# Altium schematic sheet 1.47.schdoc
size 431 x 309 mm; Symbol: Sheet-Symbol_A3; Device: Sheet-Symbol_A3; Company: 嘉立创EDA; Version: V1.0; Page Size: A3; @Project Name: AVPE 1.47寸全面屏 C2C 伏安表; @Page Count: 1; @Update Date: 2024-05-06; @Create Date: 2024-05-02; @Schematic Name: Schematic1; @Page No: 1; @Page Name: P1
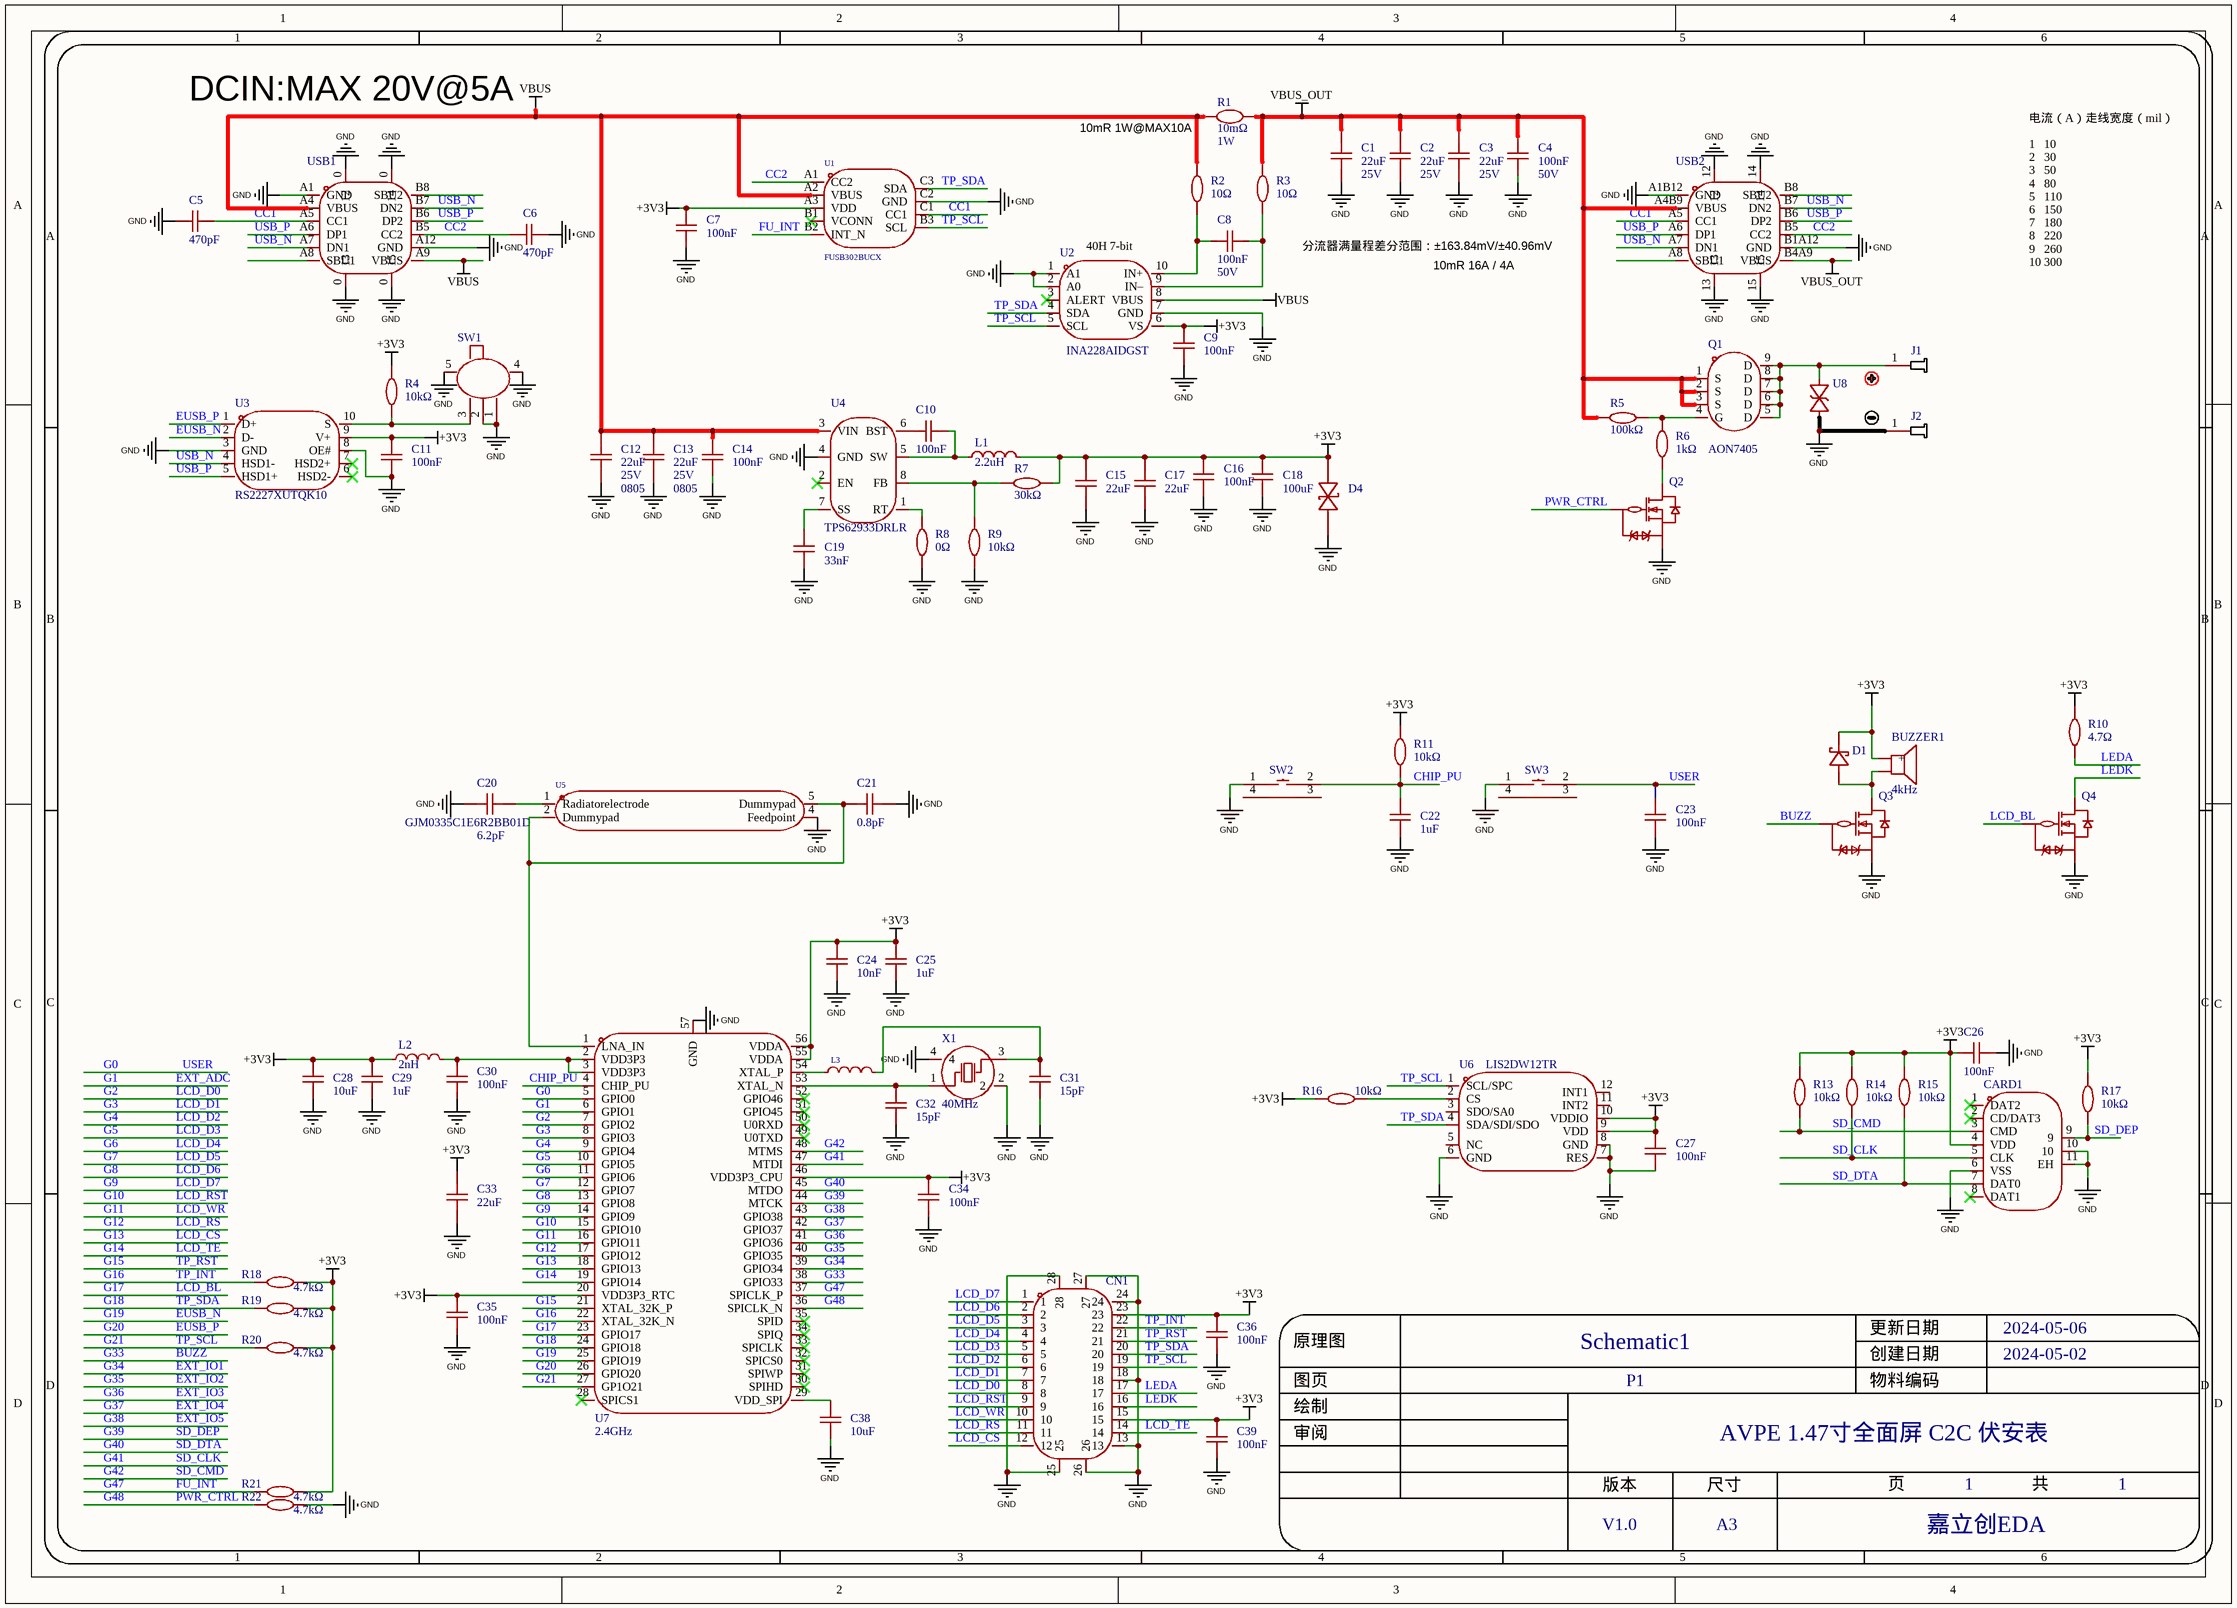
[diagram p0: 1.47.schdoc]

## Parts
BUZZER1  4kHz  [BUZ-SMD_L4.0-W4.0-P3.50-L]
C1  Voltage Rated: 25V  [C1206]  (hidden comment: 22uF)
C2  Voltage Rated: 25V  [C1206]  (hidden comment: 22uF)
C3  Voltage Rated: 25V  [C1206]  (hidden comment: 22uF)
C4  Voltage Rated: 50V  [C0402]  (hidden comment: 100nF)
C5  470pF  [C0402]
C6  470pF  [C0402]
C7  100nF  [C0402]
C8  Voltage Rated: 50V  [C0402]  (hidden comment: 100nF)
C9  100nF  [C0402]
C10  100nF  [C0402]
C11  100nF  [C0402]
C12  Supplier Footprint: 0805  Voltage Rated: 25V  [C0805]  (hidden comment: 22uF)
C13  Supplier Footprint: 0805  Voltage Rated: 25V  [C0805]  (hidden comment: 22uF)
C14  100nF  [C0402]
C15  22uF  [C0603]
C16  100nF  [C0402]
C17  22uF  [C0603]
C18  100uF  [C1206]
C19  33nF  [C0402]
C20  Manufacturer Part: GJM0335C1E6R2BB01D  [C0201]  (hidden comment: 6.2pF)
C21  0.8pF  [C0402]
C22  1uF  [C0402]
C23  100nF  [C0402]
C24  10nF  [C0402]
C25  1uF  [C0402]
C26  100nF  [C0402]
C27  100nF  [C0402]
C28  10uF  [C0402]
C29  1uF  [C0402]
C30  100nF  [C0402]
C31  15pF  [C0402]
C32  15pF  [C0402]
C33  22uF  [C0603]
C34  100nF  [C0402]
C35  100nF  [C0402]
C36  100nF  [C0402]
C38  10uF  [C0402]
C39  100nF  [C0402]
CARD1  5033981892  [TF-SMD_TF-110]  (value not drawn)
CN1  BM20B(0.8)-24DS-0.4V(51)  [CONN-SMD_BM20B-0.8-24DS-0.4V-51]  (value not drawn)
D1  1N4148WT  [SOD-523_L1.2-W0.8-LS1.6-RD]  (value not drawn)
D4  BDFN2C031V  [TSSLP-2-4_L1.0-W0.6-P0.65-BI]  (value not drawn)
J1  (no value)  [Banana_M2xφ4.4x7_2]
J2  (no value)  [Banana_M2xφ4.4x7_2]
L1  2.2uH  [L0805]
L2  2nH  [L0402]
L3  27nH  [IND-SMD_L1.0-W0.5-2]  (value not drawn)
Q1  AON7405  [DFN-8_L3.3-W3.3-P0.65-BL-3]
Q2  WNM6002-3/TR  [SOT-323-3_L2.0-W1.3-P1.30-LS2.1-BR]  (value not drawn)
Q3  WNM6002-3/TR  [SOT-323-3_L2.0-W1.3-P1.30-LS2.1-BR]  (value not drawn)
Q4  WNM6002-3/TR  [SOT-323-3_L2.0-W1.3-P1.30-LS2.1-BR]  (value not drawn)
R1  Power(Watts): 1W  [RES-SMD_L6.3-W3.3_HOLR2512]  (hidden comment: 10mΩ)
R2  10Ω  [R0402]
R3  10Ω  [R0402]
R4  10kΩ  [R0402]
R5  100kΩ  [R0402]
R6  1kΩ  [R0402]
R7  30kΩ  [R0402]
R8  0Ω  [R0402]
R9  10kΩ  [R0402]
R10  4.7Ω  [R0603]
R11  10kΩ  [R0402]
R13  10kΩ  [R0402]
R14  10kΩ  [R0402]
R15  10kΩ  [R0402]
R16  10kΩ  [R0402]
R17  10kΩ  [R0402]
R18  4.7kΩ  [R0402]
R19  4.7kΩ  [R0402]
R20  4.7kΩ  [R0402]
R21  4.7kΩ  [R0402]
R22  4.7kΩ  [R0402]
SW1  MINI MSK12CO2  [SW-SMD_MSK12CO2]  (value not drawn)
SW2  GT-TC021B-H018-L1  [SW-SMD_GT-TC021B-H018-L1]  (value not drawn)
SW3  GT-TC021B-H018-L1  [SW-SMD_GT-TC021B-H018-L1]  (value not drawn)
U1  FUSB302BUCX  [WLCSP-9_L1.3-W1.2-R3-C3-P0.40-TL]
U2  INA228AIDGST  [VSSOP-10_L3.0-W3.0-P0.50-LS4.9-BL]
U3  RS2227XUTQK10  [WQFN-10_L1.8-W1.4-P0.40-BL]
U4  TPS62933DRLR  [SOT-583-8_L2.1-W1.2-P0.50-LS1.6-BR]
U5  ANT162442ST-1000AM1  [ANT-SMD_6P-L1.6-W0.8-L]  (value not drawn)
U6  LIS2DW12TR  [LGA-12_L2.0-W2.0-P0.50-BL]
U7  2.4GHz  [QFN-56_L7.0-W7.0-P0.40-TL-EP4.0]
U8  BDFN2C241R  [DFN1006-2L-BI]  (value not drawn)
USB1  TYPEC-304A-ACP16O  [USB-TYPE-C-SMD_TYPE-C-16P-QTWT]  (value not drawn)
USB2  TYPEC-304A-ACP16O  [USB-SMD_TYPEC-304A-ACP16O]  (value not drawn)
X1  40MHz  [CRYSTAL-SMD_4P-L2.5-W2.0-BL]

## Nets
+3V3: BUZZER1.1(+) C7.1 C9.1 C11.1 C15.2 C16.1 C17.2 C18.2 C24.2 C25.2 C26.1 C27.2 C28.2 C29.2 C33.2 C34.1 C35.1 C36.1 C39.1 CARD1.4(VDD) CN1.15 CN1.23 D1.1(C) D4.2 L1.2 L2.1 R4.2 R7.2 R10.2 R11.2 R13.1 R14.1 R15.1 R16.2 R17.2 R18.1 R19.1 R20.1 R21.1 U1.A3(VDD) U2.6(VS) U3.9(V+) U6.9(VDD) U6.10(VDDIO) U7.20(VDD3P3_RTC) U7.46(VDD3P3_CPU) U7.55(VDDA) U7.56(VDDA)
GND: C1.1 C2.1 C3.1 C4.1 C5.2 C6.1 C7.2 C9.2 C11.2 C12.1 C13.1 C14.2 C15.1 C16.2 C17.1 C18.1 C19.1 C20.1 C21.2 C22.1 C23.2 C24.1 C25.1 C26.2 C27.1 C28.1 C29.1 C30.2 C31.1 C32.1 C33.1 C34.2 C35.2 C36.2 C38.1 C39.2 CARD1.6(VSS) CARD1.10 CARD1.11(EH) CN1.13 CN1.18 CN1.24 CN1.25 CN1.26 CN1.27 CN1.28 D4.1 J2.1 Q2.2(S) Q3.2(S) Q4.2(S) R8.1 R9.1 R22.1 SW1.1 SW1.2 SW1.4 SW1.5 SW2.1 SW3.1 U1.C2(GND) U2.1(A1) U2.2(A0) U2.7(GND) U3.3(GND) U3.8(OE#) U4.4(GND) U5.4(Feedpoint) U6.6(GND) U6.7(RES) U6.8(GND) U7.57(GND) U8.1(K) USB1.0(12) USB1.A1(GND) USB1.A12(GND) USB2.12 USB2.13 USB2.14 USB2.15 USB2.A1B12(GND) USB2.B1A12(GND) X1.2 X1.4
VBUS: C12.2 C13.2 C14.1 R1.1 R2.2 U1.A2(VBUS) U2.8(VBUS) U4.3(VIN) USB1.A4(VBUS) USB1.A9(VBUS)
VBUS_OUT: C1.2 C2.2 C3.2 C4.2 Q1.1(S) Q1.2(S) Q1.3(S) R1.2 R3.2 R5.2 USB2.A4B9(VBUS) USB2.B4A9(VBUS)
BUZZ: Q3.1(G) U7.38(GPIO33)  [also labelled G33]
CC1: C5.1 U1.C1(CC1) USB1.A5(CC1) USB2.A5(CC1)
CC2: C6.2 U1.A1(CC2) USB1.B5(CC2) USB2.B5(CC2)
CHIP_PU: C22.2 R11.1 SW2.2 U7.4(CHIP_PU)
EUSB_N: U3.2(D-) U7.25(GPIO19)  [also labelled G19]
EUSB_P: U3.1(D+) U7.26(GPIO20)  [also labelled G20]
EXT_ADC: U7.6(GPIO1)  [also labelled G1]
EXT_IO1: U7.39(GPIO34)  [also labelled G34]
EXT_IO2: U7.40(GPIO35)  [also labelled G35]
EXT_IO3: U7.41(GPIO36)  [also labelled G36]
EXT_IO4: U7.42(GPIO37)  [also labelled G37]
EXT_IO5: U7.43(GPIO38)  [also labelled G38]
FU_INT: R21.2 U1.B2(INT_N) U7.37(SPICLK_P)  [also labelled G47]
G0: C23.1 SW3.2 U7.5(GPIO0)  [also labelled USER]
G2: CN1.8 U7.7(GPIO2)  [also labelled LCD_D0]
G3: CN1.7 U7.8(GPIO3)  [also labelled LCD_D1]
G4: CN1.6 U7.9(GPIO4)  [also labelled LCD_D2]
G5: CN1.5 U7.10(GPIO5)  [also labelled LCD_D3]
G6: CN1.4 U7.11(GPIO6)  [also labelled LCD_D4]
G7: CN1.3 U7.12(GPIO7)  [also labelled LCD_D5]
G8: CN1.2 U7.13(GPIO8)  [also labelled LCD_D6]
G9: CN1.1 U7.14(GPIO9)  [also labelled LCD_D7]
G10: CN1.9 U7.15(GPIO10)  [also labelled LCD_RST]
G11: CN1.10 U7.16(GPIO11)  [also labelled LCD_WR]
G12: CN1.11 U7.17(GPIO12)  [also labelled LCD_RS]
G13: CN1.12 U7.18(GPIO13)  [also labelled LCD_CS]
G14: CN1.14 U7.19(GPIO14)  [also labelled LCD_TE]
G15: CN1.21 U7.21(XTAL_32K_P)  [also labelled TP_RST]
G16: CN1.22 R18.2 U7.22(XTAL_32K_N)  [also labelled TP_INT]
G17: Q4.1(G) U7.23(GPIO17)  [also labelled LCD_BL]
G18: CN1.20 R19.2 U1.C3(SDA) U2.4(SDA) U6.4(SDA/SDI/SDO) U7.24(GPIO18)  [also labelled TP_SDA]
G21: CN1.19 R20.2 U1.B3(SCL) U2.5(SCL) U6.1(SCL/SPC) U7.27(GP1O21)  [also labelled TP_SCL]
G39: CARD1.9 R17.1 U7.44(MTCK)  [also labelled SD_DEP]
G40: CARD1.7(DAT0) R15.2 U7.45(MTDO)  [also labelled SD_DTA]
G41: CARD1.5(CLK) R14.2 U7.47(MTDI)  [also labelled SD_CLK]
G42: CARD1.3(CMD) R13.2 U7.48(MTMS)  [also labelled SD_CMD]
G48: Q2.1(G) R22.2 U7.36(SPICLK_N)  [also labelled PWR_CTRL]
LEDA: CN1.17 R10.1
LEDK: CN1.16 Q4.3(D)
USB_N: U3.4(HSD1-) USB1.A7(DN1) USB1.B7(DN2) USB2.A7(DN1) USB2.B7(DN2)
USB_P: U3.5(HSD1+) USB1.A6(DP1) USB1.B6(DP2) USB2.A6(DP1) USB2.B6(DP2)
NetBUZZER1_2: BUZZER1.2 D1.2(A) Q3.3(D)
NetC8_1: C8.1 R3.1 U2.9(IN–)
NetC8_2: C8.2 R2.1 U2.10(IN+)
NetC10_1: C10.1 L1.1 U4.5(SW)
NetC10_2: C10.2 U4.6(BST)
NetC19_2: C19.2 U4.7(SS)
NetC20_2: C20.2 U5.1(Radiatorelectrode)
NetC21_1: C21.1 U5.2(Dummypad) U5.5(Dummypad) U7.1(LNA_IN)
NetC30_1: C30.1 L2.2 U7.2(VDD3P3) U7.3(VDD3P3)
NetC31_2: C31.2 L3.2 X1.3(OSC2)
NetC32_2: C32.2 U7.53(XTAL_N) X1.1(OSC1)
NetC38_2: C38.2 U7.29(VDD_SPI)
NetJ1_1: J1.1 Q1.5(D) Q1.6(D) Q1.7(D) Q1.8(D) Q1.9(D) U8.2(A)
NetL3_1: L3.1 U7.54(XTAL_P)
NetQ1_4: Q1.4(G) R5.1 R6.2
NetQ2_3: Q2.3(D) R6.1
NetR4_1: R4.1 SW1.3 U3.10(S)
NetR7_1: R7.1 R9.2 U4.8(FB)
NetR8_2: R8.2 U4.1(RT)
NetR16_1: R16.1 U6.2(CS)

Not connected (* = marked no-connect by the designer): CARD1 1(DAT2)* 2(CD/DAT3)* 8(DAT1)*; SW2 3 4; SW3 3 4; U1 B1(VCONN)*; U2 3(ALERT)*; U3 6(HSD2-)* 7(HSD2+)*; U4 2(EN)*; U6 3(SDO/SA0) 5(NC) 11(INT2) 12(INT1); U7 28(SPICS1)* 30(SPIHD)* 31(SPIWP)* 32(SPICS0)* 33(SPICLK)* 34(SPIQ)* 35(SPID)* 49(U0TXD)* 50(U0RXD)* 51(GPIO45)* 52(GPIO46)*; USB1 A8(SBU1) B8(SBU2); USB2 A8(SBU1) B8(SBU2)

## Notes on the sheet
- DCIN:MAX 20V@5A
- 10mR 1W@MAX10A
- (near U2) 40H 7-bit
- 分流器满量程差分范围：±163.84mV/±40.96mV
- 电流（A）走线宽度（mil）
  1   10
  2   30
  3   50
  4   80
  5   110
  6   150
  7   180
  8   220
  9   260
  10 300
- 10mR 16A / 4A
- 1
- 2
- 3
- 4
- 5
- 6
- A
- B
- C
- 原理图
- Schematic1
- 创建日期
- 更新日期
- 2024-05-06
- 2024-05-02
- D
- 审阅
- 绘制
- 图页
- P1
- 物料编码
- AVPE 1.47寸全面屏 C2C 伏安表
- 版本
- 尺寸
- 页
- 共
- V1.0
- A3
- 嘉立创EDA

## Library data of the parts
BUZZER1 = FUET-4020: 驱动方式:无源(外部驱动);构造类型:电磁式;频率:4kHz;声压(SPL):65dB@3V,10cm;; Manufacturer: FUET(福声科技); Add into BOM: yes; Technology Type: 电磁式; Operating Voltage: 2V~4V; Symbol: FST-4020; Device: FUET-4020; LCSC Part Name: 电压 3V 频率 4KHZ; Supplier Part: C391027; Manufacturer Part: FUET-4020; Supplier Footprint: SMD,4x4mm; JLCPCB Part Class: 扩展库; Datasheet: https://atta.szlcsc.com/upload/public/pdf/source/20191031/C391027_1FC1E5FCD05180B5ABC7B83EB3465454.pdf; Supplier: LCSC; Convert to PCB: yes; Oscillator Circuit: 无源(外部驱动); Value: 4kHz; Sound Pressure Level (SPL): 65dB@3V,10cm; Length: 4mm; Width: 4mm; Height: 2.5mm; Comment_1: 4kHz
C1-C3 = HGC1206R5226K250NSPJ: 容值:22uF;精度:±10%;额定电压:25V;材质(温度系数):X5R;; Manufacturer: Chinocera(华瓷); Add into BOM: yes; Tolerance: ±10%; Temperature Coefficient: X5R; Symbol: HGC1206R5226K250NSPJ; Device: HGC1206R5226K250NSPJ; LCSC Part Name: 22uF ±10% 25V; Supplier Part: C7432785; Manufacturer Part: HGC1206R5226K250NSPJ; Supplier Footprint: 1206; JLCPCB Part Class: 扩展库; Datasheet: https://atta.szlcsc.com/upload/public/pdf/source/20240320/FAC3FEC40A78BC5CCCE96C232A94D860.pdf; Supplier: LCSC; Convert to PCB: yes; Value: 22uF; Comment_1: 22uF
C4 C8 = CL05B104KB54PNC: 容值:100nF;精度:±10%;额定电压:50V;材质(温度系数):X7R;; Manufacturer: SAMSUNG(三星); Add into BOM: yes; Tolerance: ±10%; Temperature Coefficient: X7R; Symbol: CL05B104KB54PNC; Device: CL05B104KB54PNC; LCSC Part Name: 100nF ±10% 50V; Supplier Part: C307331; Manufacturer Part: CL05B104KB54PNC; Supplier Footprint: 0402; JLCPCB Part Class: 基础库; Datasheet: https://atta.szlcsc.com/upload/public/pdf/source/20160218/1457707763339.pdf; Supplier: LCSC; Convert to PCB: yes; Value: 100nF; Comment_1: 100nF
C5 C6 = 0402B471K500NT: 容值:470pF;精度:±10%;额定电压:50V;材质(温度系数):X7R;; Manufacturer: FH(风华); Add into BOM: yes; Tolerance: ±10%; Voltage Rated: 50V; Temperature Coefficient: X7R; Symbol: 0402B471K500NT; Device: 0402B471K500NT; LCSC Part Name: 470pF ±10% 50V; Supplier Part: C1537; Manufacturer Part: 0402B471K500NT; Supplier Footprint: 0402; JLCPCB Part Class: 扩展库; Datasheet: https://atta.szlcsc.com/upload/public/pdf/source/20200305/C486355_26A10D38EF8C2A5C37091D0039909270.pdf; Supplier: LCSC; Convert to PCB: yes; Value: 470pF; Comment_1: 470pF
C7 C9-C11 C14 C16 C23 C26 C27 C30 C34-C36 C39 = CL05B104KB54PNC: 容值:100nF;精度:±10%;额定电压:50V;材质(温度系数):X7R;; Manufacturer: SAMSUNG(三星); Add into BOM: yes; Tolerance: ±10%; Voltage Rated: 50V; Temperature Coefficient: X7R; Symbol: CL05B104KB54PNC; Device: CL05B104KB54PNC; LCSC Part Name: 100nF ±10% 50V; Supplier Part: C307331; Manufacturer Part: CL05B104KB54PNC; Supplier Footprint: 0402; JLCPCB Part Class: 基础库; Datasheet: https://atta.szlcsc.com/upload/public/pdf/source/20160218/1457707763339.pdf; Supplier: LCSC; Convert to PCB: yes; Value: 100nF; Comment_1: 100nF
C12 C13 = CL21A226MAYNNNE: 容值:22uF;精度:±20%;额定电压:25V;材质(温度系数):X5R;; Manufacturer: SAMSUNG(三星); Add into BOM: yes; Tolerance: ±20%; Temperature Coefficient: X5R; Symbol: CL21A226MAYNNNE; Device: CL21A226MAYNNNE; LCSC Part Name: 22uF ±20% 25V; Supplier Part: C602037; Manufacturer Part: CL21A226MAYNNNE; JLCPCB Part Class: 扩展库; Datasheet: https://atta.szlcsc.com/upload/public/pdf/source/20200609/C602037_1A0D619693E608A1BF6E80154254E2DB.pdf; Supplier: LCSC; Convert to PCB: yes; Value: 22uF; Comment_1: 22uF
C15 C17 C33 = CL10A226MP8NUNE: 容值:22uF;精度:±20%;额定电压:10V;材质(温度系数):X5R;; Manufacturer: SAMSUNG(三星); Add into BOM: yes; Tolerance: ±20%; Voltage Rated: 10V; Temperature Coefficient: X5R; Symbol: CL10A226MP8NUNE; Device: CL10A226MP8NUNE; LCSC Part Name: 22uF ±20% 10V; Supplier Part: C86295; Manufacturer Part: CL10A226MP8NUNE; Supplier Footprint: 0603; JLCPCB Part Class: 扩展库; Datasheet: https://atta.szlcsc.com/upload/public/pdf/source/20160218/1457707763339.pdf; Supplier: LCSC; Convert to PCB: yes; Value: 22uF; Comment_1: 22uF
C18 = CL31A107MQHNNNE: 容值:100uF;精度:±20%;额定电压:6.3V;材质(温度系数):X5R;; Manufacturer: SAMSUNG(三星); Add into BOM: yes; Tolerance: ±20%; Voltage Rated: 6.3V; Temperature Coefficient: X5R; Symbol: CL31A107MQHNNNE; Device: CL31A107MQHNNNE; Supplier: LCSC; Manufacturer Part: CL31A107MQHNNNE; Value: 100uF; Supplier Part: C15008; JLCPCB Part Class: 基础库; LCSC Part Name: 100uF ±20% 6.3V; Supplier Footprint: 1206; Datasheet: https://atta.szlcsc.com/upload/public/pdf/source/20160218/1457707763339.pdf; Convert to PCB: yes; Comment_1: 100uF
C19 = CC0402KRX7R9BB333: 容值:33nF;精度:±10%;额定电压:50V;材质(温度系数):X7R;; Manufacturer: YAGEO(国巨); Add into BOM: yes; Tolerance: ±10%; Voltage Rated: 50V; Temperature Coefficient: X7R; Symbol: CC0402KRX7R9BB333; Device: CC0402KRX7R9BB333; Supplier: LCSC; Manufacturer Part: CC0402KRX7R9BB333; Value: 33nF; Supplier Part: C106862; JLCPCB Part Class: 扩展库; LCSC Part Name: 33nF ±10% 50V; Supplier Footprint: 0402; Datasheet: https://atta.szlcsc.com/upload/public/pdf/source/20170919/C131031_1505787245477976978.pdf; Convert to PCB: yes; Comment_1: 33nF
C20 C21 = GJM0335C1ER80WB01D: 容值:0.8pF;额定电压:25V;材质(温度系数):C0G;; Manufacturer: muRata(村田); Add into BOM: yes; Voltage Rated: 25V; Temperature Coefficient: C0G; Symbol: GJM0335C1ER80WB01D; Device: GJM0335C1ER80WB01D; Supplier Footprint: 0201; JLCPCB Part Class: 扩展库; Datasheet: https://atta.szlcsc.com/upload/public/pdf/source/20200305/C490387_23319AE8C154DEB24C505E6C82A8106A.pdf; Supplier: LCSC; Convert to PCB: yes
  C20: LCSC Part Name: 6.2pF 25V; Supplier Part: C710740; Value: 6.2pF; Comment_1: 6.2pF
  C21: LCSC Part Name: 0.8pF 25V; Supplier Part: C408126; Manufacturer Part: GJM0335C1ER80WB01D; Value: 0.8pF; Comment_1: 0.8pF
C22 C25 C29 = CL05A105KP5NNNC: 容值:1uF;精度:±10%;额定电压:10V;材质(温度系数):X5R;; Manufacturer: SAMSUNG(三星); Add into BOM: yes; Tolerance: ±10%; Voltage Rated: 10V; Temperature Coefficient: X5R; Symbol: CL05A105KP5NNNC; Device: CL05A105KP5NNNC; Supplier: LCSC; Manufacturer Part: CL05A105KP5NNNC; Value: 1uF; Supplier Part: C14445; JLCPCB Part Class: 扩展库; LCSC Part Name: 1uF ±10% 10V; Supplier Footprint: 0402; Datasheet: https://atta.szlcsc.com/upload/public/pdf/source/20160218/1457707763339.pdf; Convert to PCB: yes; Comment_1: 1uF
C24 = CL05B103KB5NNNC: 容值:10nF;精度:±10%;额定电压:50V;材质(温度系数):X7R;; Manufacturer: SAMSUNG(三星); Add into BOM: yes; Tolerance: ±10%; Voltage Rated: 50V; Temperature Coefficient: X7R; Symbol: CL05B103KB5NNNC; Device: CL05B103KB5NNNC; LCSC Part Name: 10nF ±10% 50V; Supplier Part: C15195; Manufacturer Part: CL05B103KB5NNNC; Supplier Footprint: 0402; JLCPCB Part Class: 基础库; Datasheet: https://atta.szlcsc.com/upload/public/pdf/source/20160218/1457707763339.pdf; Supplier: LCSC; Convert to PCB: yes; Value: 10nF; Comment_1: 10nF
C28 C38 = CL05A106MQ5NUNC: 容值:10uF;精度:±20%;额定电压:6.3V;材质(温度系数):X5R;; Manufacturer: SAMSUNG(三星); Add into BOM: yes; Tolerance: ±20%; Voltage Rated: 6.3V; Temperature Coefficient: X5R; Symbol: CL05A106MQ5NUNC; Device: CL05A106MQ5NUNC; Supplier: LCSC; Manufacturer Part: CL05A106MQ5NUNC; Value: 10uF; Supplier Part: C15525; JLCPCB Part Class: 基础库; LCSC Part Name: 10uF ±20% 6.3V; Supplier Footprint: 0402; Datasheet: https://atta.szlcsc.com/upload/public/pdf/source/20220823/2B02EE04F8F211D38A52DCB16EB6BEBA.pdf; Convert to PCB: yes; Comment_1: 10uF
C31 C32 = 0402CG150J500NT: 容值:15pF;精度:±5%;额定电压:50V;材质(温度系数):C0G;; Manufacturer: FH(风华); Add into BOM: yes; Tolerance: ±5%; Voltage Rated: 50V; Temperature Coefficient: C0G; Symbol: 0402CG150J500NT; Device: 0402CG150J500NT; LCSC Part Name: 15pF ±5% 50V; Supplier Part: C1548; Manufacturer Part: 0402CG150J500NT; Supplier Footprint: 0402; JLCPCB Part Class: 基础库; Datasheet: https://atta.szlcsc.com/upload/public/pdf/source/20200305/C486355_26A10D38EF8C2A5C37091D0039909270.pdf; Supplier: LCSC; Convert to PCB: yes; Value: 15pF; Comment_1: 15pF
CARD1 = 5033981892: 卡连接方式:自弹式;卡类型:MicroSD卡(TF卡);连接器类型:卡座;本体最大高度:1.28mm;触头镀层:金;工作温度范围:-25℃~+85℃;; Manufacturer: MOLEX; Symbol: 503398-1892; Add into BOM: yes; Card Connection Mode: 自弹式; Connector Type: 卡座; Maximum Body Height: 1.28mm; Device: 5033981892; LCSC Part Name: 自弹式 MicroSD卡(TF卡) 卡座; Supplier Part: C428492; Manufacturer Part: 5033981892; Supplier Footprint: SMD; JLCPCB Part Class: 扩展库; Datasheet: https://atta.szlcsc.com/upload/public/pdf/source/20190912/C428492_A41EF83BB8A3DB8C0B39EF65DFC54013.pdf; Supplier: LCSC; Convert to PCB: yes; Card Type: MicroSD卡(TF卡); Contact Plating: 金; Operating Temperature Range: -25℃~+85℃; Comment_1: 5033981892
CN1 = BM20B(0.8)-24DS-0.4V(51): PIN总数:-;间距:0.4mm;公母:母;安装方式:立贴;行数:2;额定电流:300mA;工作温度范围:-35℃~+85℃;; Manufacturer: HRS(广濑); Add into BOM: yes; Pitch: 0.4mm; Gender: 母; Current Rating (Max): 300mA; Symbol: BM20B(0.8)-24DS-0.4V(51); Device: BM20B(0.8)-24DS-0.4V(51); LCSC Part Name: 间距:0.4mm 母 立贴; Supplier Part: C424537; Manufacturer Part: BM20B(0.8)-24DS-0.4V(51); Supplier Footprint: SMD,P=0.4mm; JLCPCB Part Class: 扩展库; Datasheet: https://atta.szlcsc.com/upload/public/pdf/source/20190903/C424543_A61D720FD0DF8CC4A194B7C6C8E1C4BB.pdf; Supplier: LCSC; Convert to PCB: yes; Number of Pins: -; Mounting Style: 立贴; Number of Rows: 2; Contact Plating: 金; Operating Temperature Range: -35℃~+85℃; Comment_1: BM20B(0.8)-24DS-0.4V(51)
D1 = 1N4148WT_C727112: 二极管配置:独立式;正向压降(Vf):1.25V@150mA;直流反向耐压(Vr):75V;平均整流电流(Io):125mA;反向恢复时间(trr):4ns;; Manufacturer: TWGMC(台湾迪嘉); Add into BOM: yes; Diode Configuration: 独立式; Reverse Voltage (Vr): 75V; Average Rectified Current (Io): 125mA; Reverse Leakage Current: 1uA@75V; Reverse Recovery Time (trr): 4ns; Symbol: 1N4148WT_C727112; Device: 1N4148WT_C727112; LCSC Part Name: 电压:75V 电流:125mA; Supplier Part: C727112; Manufacturer Part: 1N4148WT; Supplier Footprint: SOD-523; JLCPCB Part Class: 扩展库; Datasheet: https://atta.szlcsc.com/upload/public/pdf/source/20200828/C727112_FCA71CBB186A515518FBD85DA79D41CF.pdf; Supplier: LCSC; Convert to PCB: yes; Forward Voltage (Vf@If): 1.25V@150mA; Operating Temperature: -65℃~+150℃@(Tj); Comment_1: 1N4148WT
D4 = BDFN2C031V: 反向截止电压(Vrwm):3.3V;最大钳位电压:8V;峰值脉冲电流(Ipp)@10/1000us:11A@8/20us;击穿电压:3.7V;; Manufacturer: BORN(伯恩半导体); Add into BOM: yes; Reverse Stand-Off Voltage (Vrwm): 3.3V; Maximum Clamping Voltage: 8V; Breakdown Voltage: 3.7V; Type: TVS; Symbol: BDFN2C031V; Device: BDFN2C031V; Supplier: LCSC; Supplier Part: C152027; Manufacturer Part: BDFN2C031V; JLCPCB Part Class: 扩展库; LCSC Part Name: 双向TVS 3.3V截止 11A峰值脉冲; Supplier Footprint: DFN-2L; Datasheet: https://atta.szlcsc.com/upload/public/pdf/source/20180207/C152027_15179949174661359126.pdf; Convert to PCB: yes; Peak Pulse Current (Ipp)@10/1000us: 11A@8/20us; Comment_1: BDFN2C031V
J1 J2 = Banana_M2xφ4.4x7: K2台阶插座,Banana_M2xφ4.4x7; Add into BOM: yes; Symbol: Banana_M2xφ4.4x7; Device: Banana_M2xφ4.4x7; Convert to PCB: yes; Comment_1: Banana_M2xφ4.4x7
L1 = MLP2012H2R2MT0S1: 电感值:2.2uH;精度:±20%;额定电流:1A;; Manufacturer: TDK; Add into BOM: yes; Tolerance: ±20%; Rated Current: 1A; DC Resistance (DCR): 150mΩ; Symbol: MLP2012H2R2MT0S1; Device: MLP2012H2R2MT0S1; LCSC Part Name: 2.2uH ±20%; Supplier Part: C383369; Manufacturer Part: MLP2012H2R2MT0S1; Supplier Footprint: 0805; JLCPCB Part Class: 扩展库; Datasheet: https://atta.szlcsc.com/upload/public/pdf/source/20200619/C383369_BBB8A606AA8670BE18592D802F1F69D5.pdf; Supplier: LCSC; Convert to PCB: yes; Value: 2.2uH; Comment_1: 2.2uH
L2 = SDCL1005C2N0STDF: 电感值:2nH;精度:-;额定电流:300mA;饱和电流(Isat):-;直流电阻(DCR):200mΩ;; Manufacturer: Sunlord(顺络); Add into BOM: yes; Rated Current: 300mA; DC Resistance (DCR): 200mΩ; Q @ Freq: 8@100MHz; Frequency - Self Resonant: 6GHz; Symbol: SDCL1005C2N0STDF; Device: SDCL1005C2N0STDF; Supplier: LCSC; Manufacturer Part: SDCL1005C2N0STDF; Value: 2nH; Supplier Part: C43365; JLCPCB Part Class: 扩展库; LCSC Part Name: 2nH; Supplier Footprint: 0402; Datasheet: https://atta.szlcsc.com/upload/public/pdf/source/20231027/6126A3AAC5912C34388756BE22DEE00C.pdf; Convert to PCB: yes; Tolerance: -; Saturation Current (Isat): -; Ratings: -; Comment_1: 2nH
L3 = LQW15AN27NG00D: 电感值:27nH;精度:±2%;额定电流:280mA;饱和电流(Isat):-;; Manufacturer: muRata(村田); Add into BOM: yes; Tolerance: ±2%; Rated Current: 280mA; DC Resistance (DCR): 520mΩ; Symbol: LQW15AN27NG00D; Device: LQW15AN27NG00D; Supplier: LCSC; Manufacturer Part: LQW15AN27NG00D; Value: 27nH; Supplier Part: C98057; JLCPCB Part Class: 扩展库; LCSC Part Name: 27nH ±2%; Supplier Footprint: 0402; Datasheet: https://atta.szlcsc.com/upload/public/pdf/source/20191016/C437364_463D6516B3BAE72B1DA0754F3D9B8308.pdf; Convert to PCB: yes; Saturation Current (Isat): -; Ratings: -; Comment_1: 27nH
Q1 = AON7405: 类型:1个P沟道;漏源电压(Vdss):30V;连续漏极电流(Id):50A;功率(Pd):6.25W;导通电阻(RDS(on)@Vgs,Id):6.2mΩ@10V,20A;阈值电压(Vgs(th)@Id):2.8V@250uA;; Manufacturer: AOS; Add into BOM: yes; Type: 1个P沟道; Drain Source Voltage (Vdss): 30V; Continuous Drain Current (Id): 50A; Power Dissipation (Pd): 6.25W; Symbol: AON7405; Device: AON7405; LCSC Part Name: 1个P沟道 耐压:30V 电流:50A; Supplier Part: C431194; Manufacturer Part: AON7405; Supplier Footprint: DFN-8(3.3x3.3); JLCPCB Part Class: 扩展库; Datasheet: https://atta.szlcsc.com/upload/public/pdf/source/20190920/C431194_88D1A85EB5F03F954D3EA863BE064D96.pdf; Supplier: LCSC; Convert to PCB: yes; Drain Source On Resistance (RDS(on)@Vgs,Id): 6.2mΩ@10V,20A; Gate Threshold Voltage (Vgs(th)@Id): 2.8V@250uA; Comment_1: AON7405
Q2-Q4 = WNM6002-3/TR: 类型:N沟道;漏源电压(Vdss):60V;连续漏极电流(Id):300mA;功率(Pd):370mW;导通电阻(RDS(on)@Vgs,Id):2Ω@10V,370mA;阈值电压(Vgs(th)@Id):2V@250uA;; Manufacturer: WILLSEMI(韦尔); Add into BOM: yes; Type: N沟道; Drain Source Voltage (Vdss): 60V; Continuous Drain Current (Id): 300mA; Power Dissipation (Pd): 370mW; Symbol: WNM6002-3/TR; Device: WNM6002-3/TR; LCSC Part Name: N沟道 耐压:60V 电流:300mA; Supplier Part: C501342; Manufacturer Part: WNM6002-3/TR; Supplier Footprint: SOT-323-3; JLCPCB Part Class: 扩展库; Datasheet: https://atta.szlcsc.com/upload/public/pdf/source/20200324/C501342_29E9D9C6E1199381F55B20D6C6C9F64A.pdf; Supplier: LCSC; Convert to PCB: yes; Drain Source On Resistance (RDS(on)@Vgs,Id): 2Ω@10V,370mA; Gate Threshold Voltage (Vgs(th)@Id): 2V@250uA; Comment_1: WNM6002-3/TR
R1 = HoLR2512-1W-10mR-1%-15ppm: 电阻类型:采样电阻;阻值:10mΩ;精度:±1%;功率:1W;温度系数:±15ppm/℃;安装方式:贴片;; Manufacturer: Milliohm(毫欧); Add into BOM: yes; Tolerance: ±1%; Mounting Sytle: 贴片; Symbol: HOLR2512-1W-10MR-1%-15PPM; Device: HoLR2512-1W-10mR-1%-15ppm; LCSC Part Name: 10mΩ ±1% 1W; Supplier Part: C2885415; Manufacturer Part: HoLR2512-1W-10mR-1%-15ppm; Supplier Footprint: 2512; JLCPCB Part Class: 扩展库; Datasheet: https://atta.szlcsc.com/upload/public/pdf/source/20210907/EFC5E613EA602FA39B24B3E78396C7B7.pdf; Supplier: LCSC; Convert to PCB: yes; Type: 采样电阻; Value: 10mΩ; Temperature Coefficient: ±15ppm/℃; Comment_1: 10mΩ
R2 R3 = 0402WGF100JTCE: 电阻类型:厚膜电阻;阻值:10Ω;精度:±1%;功率:62.5mW;最大工作电压:50V;温度系数:±200ppm/℃;; Manufacturer: UNI-ROYAL(厚声); Add into BOM: yes; Tolerance: ±1%; Power(Watts): 62.5mW; Overload Voltage (Max): 50V; Symbol: 0402WGF100JTCE; Device: 0402WGF100JTCE; Supplier: LCSC; Manufacturer Part: 0402WGF100JTCE; Supplier Part: C25077; Value: 10Ω; JLCPCB Part Class: 基础库; LCSC Part Name: 10Ω ±1% 62.5mW 厚膜电阻; Supplier Footprint: 0402; Datasheet: https://atta.szlcsc.com/upload/public/pdf/source/20200306/C422600_1E6D84923E4A46A82E41ADD87F860B5C.pdf; Convert to PCB: yes; Type: 厚膜电阻; Temperature Coefficient: ±200ppm/℃; Operating Temperature Range: -55℃~+155℃; Comment_1: 10Ω
R4 R9 R11 R13-R17 = 0402WGF1002TCE: 电阻类型:厚膜电阻;阻值:10kΩ;精度:±1%;功率:62.5mW;最大工作电压:50V;温度系数:±100ppm/℃;; Manufacturer: UNI-ROYAL(厚声); Add into BOM: yes; Tolerance: ±1%; Power(Watts): 62.5mW; Overload Voltage (Max): 50V; Symbol: 0402WGF1002TCE; Device: 0402WGF1002TCE; LCSC Part Name: 10kΩ ±1% 62.5mW 厚膜电阻; Supplier Part: C25744; Manufacturer Part: 0402WGF1002TCE; Supplier Footprint: 0402; JLCPCB Part Class: 基础库; Datasheet: https://atta.szlcsc.com/upload/public/pdf/source/20200306/C422600_1E6D84923E4A46A82E41ADD87F860B5C.pdf; Supplier: LCSC; Convert to PCB: yes; Type: 厚膜电阻; Value: 10kΩ; Temperature Coefficient: ±100ppm/℃; Operating Temperature Range: -55℃~+155℃; Comment_1: 10kΩ
R5 = 0402WGF1003TCE: 电阻类型:厚膜电阻;阻值:100kΩ;精度:±1%;功率:62.5mW;最大工作电压:50V;温度系数:±100ppm/℃;; Manufacturer: UNI-ROYAL(厚声); Add into BOM: yes; Tolerance: ±1%; Power(Watts): 62.5mW; Overload Voltage (Max): 50V; Symbol: 0402WGF1003TCE; Device: 0402WGF1003TCE; Supplier: LCSC; Manufacturer Part: 0402WGF1003TCE; Supplier Part: C25741; Value: 100kΩ; JLCPCB Part Class: 基础库; LCSC Part Name: 100kΩ ±1% 62.5mW 厚膜电阻; Supplier Footprint: 0402; Datasheet: https://atta.szlcsc.com/upload/public/pdf/source/20200306/C422600_1E6D84923E4A46A82E41ADD87F860B5C.pdf; Convert to PCB: yes; Type: 厚膜电阻; Temperature Coefficient: ±100ppm/℃; Operating Temperature Range: -55℃~+155℃; Comment_1: 100kΩ
R6 = 0402WGF1001TCE: 电阻类型:厚膜电阻;阻值:1kΩ;精度:±1%;功率:62.5mW;最大工作电压:50V;温度系数:±100ppm/℃;; Manufacturer: UNI-ROYAL(厚声); Add into BOM: yes; Tolerance: ±1%; Power(Watts): 62.5mW; Overload Voltage (Max): 50V; Symbol: 0402WGF1001TCE; Device: 0402WGF1001TCE; Supplier: LCSC; Manufacturer Part: 0402WGF1001TCE; Supplier Part: C11702; Value: 1kΩ; JLCPCB Part Class: 基础库; LCSC Part Name: 1kΩ ±1% 62.5mW 厚膜电阻; Supplier Footprint: 0402; Datasheet: https://atta.szlcsc.com/upload/public/pdf/source/20200306/C422600_1E6D84923E4A46A82E41ADD87F860B5C.pdf; Convert to PCB: yes; Type: 厚膜电阻; Temperature Coefficient: ±100ppm/℃; Operating Temperature Range: -55℃~+155℃; Comment_1: 1kΩ
R7 = 0402WGF3002TCE: 电阻类型:厚膜电阻;阻值:30kΩ;精度:±1%;功率:62.5mW;最大工作电压:50V;温度系数:±100ppm/℃;; Manufacturer: UNI-ROYAL(厚声); Add into BOM: yes; Tolerance: ±1%; Power(Watts): 62.5mW; Overload Voltage (Max): 50V; Symbol: 0402WGF3002TCE; Device: 0402WGF3002TCE; Supplier: LCSC; Manufacturer Part: 0402WGF3002TCE; Supplier Part: C25776; Value: 30kΩ; JLCPCB Part Class: 扩展库; LCSC Part Name: 30kΩ ±1% 62.5mW 厚膜电阻; Supplier Footprint: 0402; Datasheet: https://atta.szlcsc.com/upload/public/pdf/source/20200306/C422600_1E6D84923E4A46A82E41ADD87F860B5C.pdf; Convert to PCB: yes; Type: 厚膜电阻; Temperature Coefficient: ±100ppm/℃; Operating Temperature Range: -55℃~+155℃; Comment_1: 30kΩ
R8 = 0402WGF0000TCE: 电阻类型:厚膜电阻;阻值:0Ω;精度:±1%;功率:62.5mW;最大工作电压:50V;温度系数:±800ppm/℃;; Manufacturer: UNI-ROYAL(厚声); Add into BOM: yes; Tolerance: ±1%; Power(Watts): 62.5mW; Overload Voltage (Max): 50V; Symbol: 0402WGF0000TCE; Device: 0402WGF0000TCE; Supplier: LCSC; Manufacturer Part: 0402WGF0000TCE; Supplier Part: C17168; Value: 0Ω; JLCPCB Part Class: 基础库; LCSC Part Name: 0Ω ±1% 62.5mW 厚膜电阻; Supplier Footprint: 0402; Datasheet: https://atta.szlcsc.com/upload/public/pdf/source/20200306/C422600_1E6D84923E4A46A82E41ADD87F860B5C.pdf; Convert to PCB: yes; Type: 厚膜电阻; Temperature Coefficient: ±800ppm/℃; Operating Temperature Range: -55℃~+155℃; Comment_1: 0Ω
R10 = 0603WAF470KT5E: 电阻类型:厚膜电阻;阻值:4.7Ω;精度:±1%;功率:100mW;最大工作电压:75V;温度系数:±400ppm/℃;; Manufacturer: UNI-ROYAL(厚声); Add into BOM: yes; Tolerance: ±1%; Power(Watts): 100mW; Overload Voltage (Max): 75V; Symbol: 0603WAF470KT5E; Device: 0603WAF470KT5E; Supplier: LCSC; Manufacturer Part: 0603WAF470KT5E; Supplier Part: C23164; Value: 4.7Ω; JLCPCB Part Class: 基础库; LCSC Part Name: 4.7Ω ±1% 100mW 厚膜电阻; Supplier Footprint: 0603; Datasheet: https://atta.szlcsc.com/upload/public/pdf/source/20200306/C422600_1E6D84923E4A46A82E41ADD87F860B5C.pdf; Convert to PCB: yes; Type: 厚膜电阻; Temperature Coefficient: ±400ppm/℃; Operating Temperature Range: -55℃~+155℃; Comment_1: 4.7Ω
R18-R22 = 0402WGF4701TCE: 电阻类型:厚膜电阻;阻值:4.7kΩ;精度:±1%;功率:62.5mW;最大工作电压:50V;温度系数:±100ppm/℃;; Manufacturer: UNI-ROYAL(厚声); Add into BOM: yes; Tolerance: ±1%; Power(Watts): 62.5mW; Overload Voltage (Max): 50V; Symbol: 0402WGF4701TCE; Device: 0402WGF4701TCE; Supplier: LCSC; Manufacturer Part: 0402WGF4701TCE; Supplier Part: C25900; Value: 4.7kΩ; JLCPCB Part Class: 基础库; LCSC Part Name: 4.7kΩ ±1% 62.5mW 厚膜电阻; Supplier Footprint: 0402; Datasheet: https://atta.szlcsc.com/upload/public/pdf/source/20200306/C422600_1E6D84923E4A46A82E41ADD87F860B5C.pdf; Convert to PCB: yes; Type: 厚膜电阻; Temperature Coefficient: ±100ppm/℃; Operating Temperature Range: -55℃~+155℃; Comment_1: 4.7kΩ
SW1 = MINI MSK12CO2: 电路结构:单刀双掷;安装方式:卧贴;开关颜色:-;额定电流(DC):50mA;额定电压(DC):12V;额定电流(AC):-;额定电压(AC):-;机械寿命:1万次;; Manufacturer: SHOU HAN(首韩); Add into BOM: yes; Circuit: 单刀双掷; Pin Style: SMD接片; Switch Length: 5mm; Switch Width: 2.75mm; Switch Height: 1.4mm; Current Rating (DC): 50mA; Voltage Rating (DC): 12V; Mechanical Life: 1万次; Symbol: MINI MSK12CO2; Device: MINI MSK12CO2; LCSC Part Name: 迷你七脚两档侧拨拨动 mini七7脚 微型拨动; Supplier Part: C2681570; Manufacturer Part: MINI MSK12CO2; Supplier Footprint: SMD; JLCPCB Part Class: 扩展库; Datasheet: https://atta.szlcsc.com/upload/public/pdf/source/20210224/C2681570_D263F9C605E4588A4AE6114B72AE4C72.pdf; Supplier: LCSC; Convert to PCB: yes; Actuator Style: -; Mounting Style: 卧贴; Actuator Color: -; Current Rating (AC): -; Voltage Rating (AC): -; Operating Temperature: -16℃~+60℃; Comment_1: MINI MSK12CO2
SW2 SW3 = GT-TC021B-H018-L1: 电路结构:单刀单掷;按钮形状:矩形按钮;作用力:250gf;安装方式:卧贴;开关长度:5.6mm;开关宽度:4mm;开关高度:1.8mm;带支架:带支架;触点电流:50mA;额定电压(DC):12V;绝缘电阻:100MΩ;带灯:无;机械寿命:5万次;; Manufacturer: G-Switch(品赞); Add into BOM: yes; Circuit: 单刀单掷; Actuator Style: 矩形按钮; Operating Force: 250gf; Switch Length: 5.6mm; Switch Width: 4mm; Switch Height: 1.8mm; Strike Gundam: 带支架; Contact Current: 50mA; Voltage Rating (DC): 12V; Insulation Resistance: 100MΩ; Actuator/Cap Color: 白色; With Lamp: 无; Pin Style: SMD接片; Mechanical Life: 5万次; Symbol: GT-TC021B-H018-L1; Device: GT-TC021B-H018-L1; LCSC Part Name: 5.6*4*1.8mm 卧贴 轻触开关; Supplier Part: C963493; Manufacturer Part: GT-TC021B-H018-L1; Supplier Footprint: SMD; JLCPCB Part Class: 扩展库; Datasheet: https://atta.szlcsc.com/upload/public/pdf/source/20201201/C963212_A3F74D7D359D0B352A0FB9F1112D883A.pdf; Supplier: LCSC; Convert to PCB: yes; Mounting Style: 卧贴; Operating Temperature: -30℃~+85℃; Comment_1: GT-TC021B-H018-L1
U1 = FUSB302BUCX: 应用功能:控制器;接口协议:USB;; Manufacturer: onsemi(安森美); Add into BOM: yes; Applications Function: 控制器; Protocol: USB; Supply Voltage: 2.8V~5.5V; Symbol: FUSB302BUCX; Device: FUSB302BUCX; Supplier: LCSC; Supplier Part: C891307; Manufacturer Part: FUSB302BUCX; JLCPCB Part Class: 扩展库; LCSC Part Name: 可编程 USB Type-C 控制器，带 PD（默认 SNK）; Supplier Footprint: WLCSP-9(1.2x1.3); Datasheet: https://atta.szlcsc.com/upload/public/pdf/source/20210625/C891307_1D7648C55FCBE18FD4CED19D1D957F92.pdf; Convert to PCB: yes; Operating Temperature: -40℃~+85℃; Comment_1: FUSB302BUCX
U2 = INA228AIDGST: Manufacturer: TI(德州仪器); Add into BOM: yes; Symbol: INA228AIDGST; Device: INA228AIDGST; Supplier: LCSC; Supplier Part: C2862904; Manufacturer Part: INA228AIDGST; JLCPCB Part Class: 扩展库; LCSC Part Name: INA228AIDGST; Supplier Footprint: VSSOP-10-0.5mm; Datasheet: https://www.ti.com/cn/lit/gpn/ina228; Convert to PCB: yes; Comment_1: INA228AIDGST
U3 = RS2227XUTQK10: 开关电路:-;; Manufacturer: RUNIC(润石); Add into BOM: yes; Symbol: RS2227XUTQK10; Device: RS2227XUTQK10; Supplier: LCSC; Supplier Part: C783419; Manufacturer Part: RS2227XUTQK10; JLCPCB Part Class: 扩展库; LCSC Part Name: 模拟开关; Supplier Footprint: WQFN-10(1.4x1.8); Datasheet: https://atta.szlcsc.com/upload/public/pdf/source/20200914/C783419_7DE0403E7FB394838894EC6D91B9FF13.pdf; Convert to PCB: yes; Switch Circuit: -; Comment_1: RS2227XUTQK10
U4 = TPS62933DRLR: 功能类型:降压型;输出类型:可调;输入电压:3.8V~30V;输出电压:800mV~22V;输出电流(最大值):3A;; Manufacturer: TI(德州仪器); Add into BOM: yes; Function: 降压型; Output Type: 可调; Output Current (Max): 3A; Switching Frequency: 2.2MHz; Synchronous Rectification: 是; Number of Outputs: 1; Topology: 降压式; Switch tube (built-in/external): 内置; Symbol: TPS62933DRLR; Device: TPS62933DRLR; Supplier: LCSC; Supplier Part: C3200405; Manufacturer Part: TPS62933DRLR; LCSC Part Name: TPS62933DRLR; Supplier Footprint: SOT-583; Datasheet: https://www.ti.com/cn/lit/gpn/tps62933; Convert to PCB: yes; Input Voltage: 3.8V~30V; Output Voltage: 800mV~22V; Operating Temperature: -40℃~+150℃@(TJ); Comment_1: TPS62933DRLR
U5 = ANT162442ST-1000AM1: 天线类型:芯片天线;中心频点:2.442GHz;驻波比:3;; Manufacturer: TDK; Add into BOM: yes; Antenna Type: 芯片天线; VSWR: 3; Symbol: ANT162442ST-1000AM1; Device: ANT162442ST-1000AM1; Supplier: LCSC; Supplier Part: C5119334; Manufacturer Part: ANT162442ST-1000AM1; JLCPCB Part Class: 扩展库; LCSC Part Name: ANT162442ST-1000AM1; Supplier Footprint: SMD; Datasheet: https://atta.szlcsc.com/upload/public/pdf/source/20220726/5250FEEEC00E5085DF56EA09B238E8B2.pdf; Convert to PCB: yes; Central Frequency: 2.442GHz; Comment_1: ANT162442ST-1000AM1
U6 = LIS2DW12TR: Manufacturer: ST(意法半导体); Add into BOM: yes; Symbol: LIS2DW12TR; Device: LIS2DW12TR; LCSC Part Name: LIS2DW12TR; Supplier Part: C189624; Manufacturer Part: LIS2DW12TR; Supplier Footprint: LGA-12; Datasheet: https://atta.szlcsc.com/upload/public/pdf/source/20180403/C189624_150963097ED842400E055DE40577DCB1.pdf; Supplier: LCSC; Convert to PCB: yes; Comment_1: LIS2DW12TR
U7 = ESP32-S3FH4R2: 核心处理器:LX7芯片;频率:2.4GHz;天线形式:-;发射功率:21dBm;接收灵敏度:-;; Manufacturer: ESPRESSIF(乐鑫); Add into BOM: yes; Core Processor: LX7芯片; Support Interface: I2C；GPIO；JTAG；IrDA；SPI；I2S；PCM；SDIO；PWM；ADC; Output Power: 21dBm; Symbol: ESP32-S3FH4R2; Device: ESP32-S3FH4R2; LCSC Part Name: ESP32-S3FH4R2; Supplier Part: C3013940; Manufacturer Part: ESP32-S3FH4R2; Supplier Footprint: QFN-56(7x7); JLCPCB Part Class: 扩展库; Datasheet: https://atta.szlcsc.com/upload/public/pdf/source/20231007/F0479719405F4458344DA2610DF37B97.pdf; Supplier: LCSC; Convert to PCB: yes; Wireless Standard: -; Value: 2.4GHz; Antenna Type: -; Operating Voltage: -; Receive  Current: -; Send  Current: -; Sensitivity: -; Operating Temperature: -; Comment_1: 2.4GHz
U8 = BDFN2C241R: 反向截止电压(Vrwm):24V;; Manufacturer: BORN(伯恩半导体); Add into BOM: yes; Reverse Stand-Off Voltage (Vrwm): 24V; Symbol: BDFN2C241R; Device: BDFN2C241R; LCSC Part Name: BDFN2C241R; Supplier Part: C18199521; Manufacturer Part: BDFN2C241R; Supplier Footprint: DFN1006; Datasheet: https://atta.szlcsc.com/upload/public/pdf/source/20230925/6B9DC4383CBC032E3F8EFD077BCC83F2.pdf; Supplier: LCSC; Convert to PCB: yes; Type: ESD; Comment_1: BDFN2C241R
USB1 USB2 = TYPEC-304A-ACP16O: 连接器类型:Type-C;标准:USB 3.1;公母:母;端口数量:1;触点数量:16P;安装方式:卧贴;额定电流 - 电源:5A;触头材质:-;触头镀层:-;工作温度范围:-45℃~+85℃;焊接温度(最大值):260℃;; Manufacturer: XUNPU(讯普); Add into BOM: yes; Connector Type: Type-C; Gender: 母; Number of Ports: 1; Number of Contacts: 16P; Current Rating - Power (Max): 5A; Soldering Temperature(Max): 260℃; Symbol: TYPEC-304A-ACP16O; Device: TYPEC-304A-ACP16O; Supplier: LCSC; Supplier Part: C2909610; Manufacturer Part: TYPEC-304A-ACP16O; JLCPCB Part Class: 扩展库; LCSC Part Name: Type-C 母 卧贴; Supplier Footprint: SMD; Datasheet: https://atta.szlcsc.com/upload/public/pdf/source/20211029/5A76838C591B377E5BF09726BF37DE5A.pdf; Convert to PCB: yes; Standard: USB 3.1; Mounting Style: 卧贴; Contact Material: -; Contact Plating: -; Operating Temperature Range: -45℃~+85℃; Comment_1: TYPEC-304A-ACP16O
X1 = TXM40M0004252HBCEO00T: 晶振类型:贴片晶振;频率:40MHz;常温频差:±10ppm;外接负载电容:15pF;频率稳定度(全温):±30ppm;; Manufacturer: YJX(雅晶鑫); Add into BOM: yes; Crystal Type: 贴片晶振; Normal temperature Frequency Tolerance: ±10ppm; External load capacitor: 15pF; Frequency Stability(Full temperature range): ±30ppm; Equivalent Series Resistance (ESR): 25Ω; Symbol: TXM40M0004252HBCEO00T; Device: TXM40M0004252HBCEO00T; LCSC Part Name: 40MHz ±10ppm 15pF; Supplier Part: C284176; Manufacturer Part: TXM40M0004252HBCEO00T; Supplier Footprint: SMD2520-4P; JLCPCB Part Class: 扩展库; Datasheet: https://atta.szlcsc.com/upload/public/pdf/source/20180910/C284176_7C227CDEF2A90AF7BF47AD2F9582364C.pdf; Supplier: LCSC; Convert to PCB: yes; Value: 40MHz; Operating Temperature: -40℃~+85℃; Comment_1: 40MHz